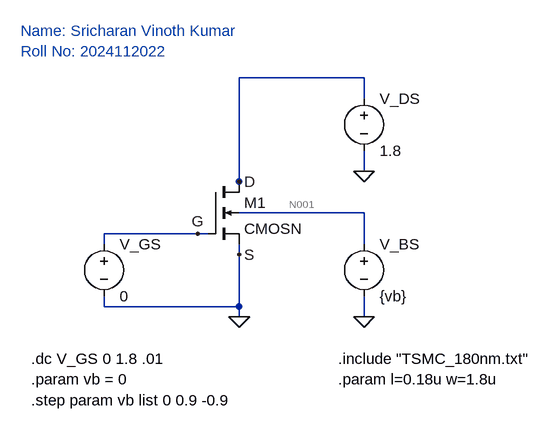
[diagram p0: schematic 3.2.asc]
3.2.asc, the LTspice schematic file:
Version 4.1
SHEET 1 880 680
WIRE 400 -64 208 -64
WIRE 400 -32 400 -64
WIRE 400 80 400 48
WIRE 208 96 208 -64
WIRE 208 112 208 96
WIRE 400 144 208 144
WIRE 144 176 0 176
WIRE 160 176 144 176
WIRE 0 192 0 176
WIRE 400 192 400 144
WIRE 208 208 208 192
WIRE 0 288 0 272
WIRE 208 288 208 208
WIRE 208 288 0 288
WIRE 208 304 208 288
WIRE 400 304 400 272
FLAG 400 304 0
FLAG 208 304 0
FLAG 400 80 0
FLAG 208 96 D
FLAG 208 208 S
FLAG 144 176 G
SYMBOL nmos4 160 96 R0
SYMATTR InstName M1
SYMATTR Value CMOSN
SYMATTR Value2 l=l w=w ad=2.5*l*w as=2.5*l*w pd=5*l+2*w ps=5*l+2*w
SYMBOL voltage 400 176 R0
WINDOW 123 0 0 Left 0
WINDOW 39 0 0 Left 0
SYMATTR InstName V_BS
SYMATTR Value {vb}
SYMBOL voltage 0 176 R0
SYMATTR InstName V_GS
SYMATTR Value 0
SYMBOL voltage 400 -48 R0
WINDOW 123 0 0 Left 0
WINDOW 39 0 0 Left 0
SYMATTR InstName V_DS
SYMATTR Value 1.8
TEXT 360 368 Left 2 !.include "TSMC_180nm.txt"
TEXT 360 400 Left 2 !.param l=0.18u w=1.8u
TEXT -112 368 Left 2 !.dc V_GS 0 1.8 .01
TEXT -128 -136 Left 2 ;Name: Sricharan Vinoth Kumar\nRoll No: 2024112022
TEXT -112 400 Left 2 !.param vb = 0
TEXT -112 432 Left 2 !.step param vb list 0 0.9 -0.9

The netlist it stands for:
* 3.2.asc
M1 D G 0 N001 CMOSN l=l w=w ad=2.5*l*w as=2.5*l*w pd=5*l+2*w ps=5*l+2*w
V_BS N001 0 {vb}
V_GS G 0 0
V_DS D 0 1.8
.model NMOS NMOS
.model PMOS PMOS
.lib standard.mos
.include "TSMC_180nm.txt"
.param l=0.18u w=1.8u
.dc V_GS 0 1.8 .01
* Name: Sricharan Vinoth Kumar
* Roll No: 2024112022
.param vb = 0
.step param vb list 0 0.9 -0.9
.backanno
.end

* Results of the author's LTspice run, read from the files saved beside the schematic
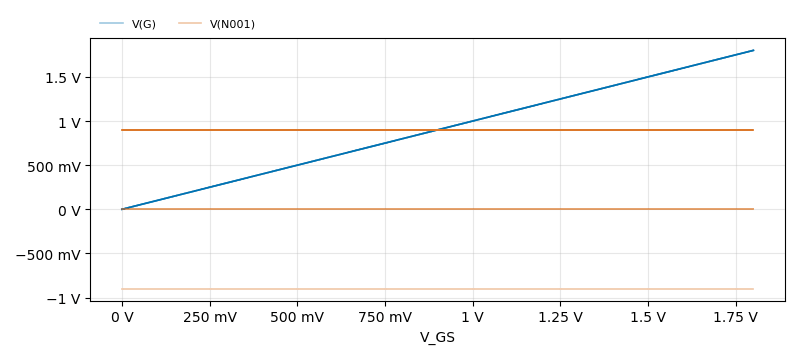
[diagram p1: DC transfer characteristic of 3.2.asc, plotted from the saved traces]
* DC transfer characteristic, 3 runs:
*   V(G) [vb=-0.9]: 0 V at V_GS=0 V, 1.8 V at V_GS=1.8 V, min 0 V, max 1.8 V
*   V(G) [vb=0]: 0 V at V_GS=0 V, 1.8 V at V_GS=1.8 V, min 0 V, max 1.8 V
*   V(G) [vb=0.9]: 0 V at V_GS=0 V, 1.8 V at V_GS=1.8 V, min 0 V, max 1.8 V
*   V(N001) [vb=-0.9]: -900 mV at V_GS=0 V, -900 mV at V_GS=1.8 V, min -900 mV, max -900 mV
*   V(N001) [vb=0]: 0 V at V_GS=0 V, 0 V at V_GS=1.8 V, min 0 V, max 0 V
*   V(N001) [vb=0.9]: 900 mV at V_GS=0 V, 900 mV at V_GS=1.8 V, min 900 mV, max 900 mV